# Altium schematic sheet argus_I.SchDoc: document_tile
size A; SheetNumber: 1; SheetTotal: 1
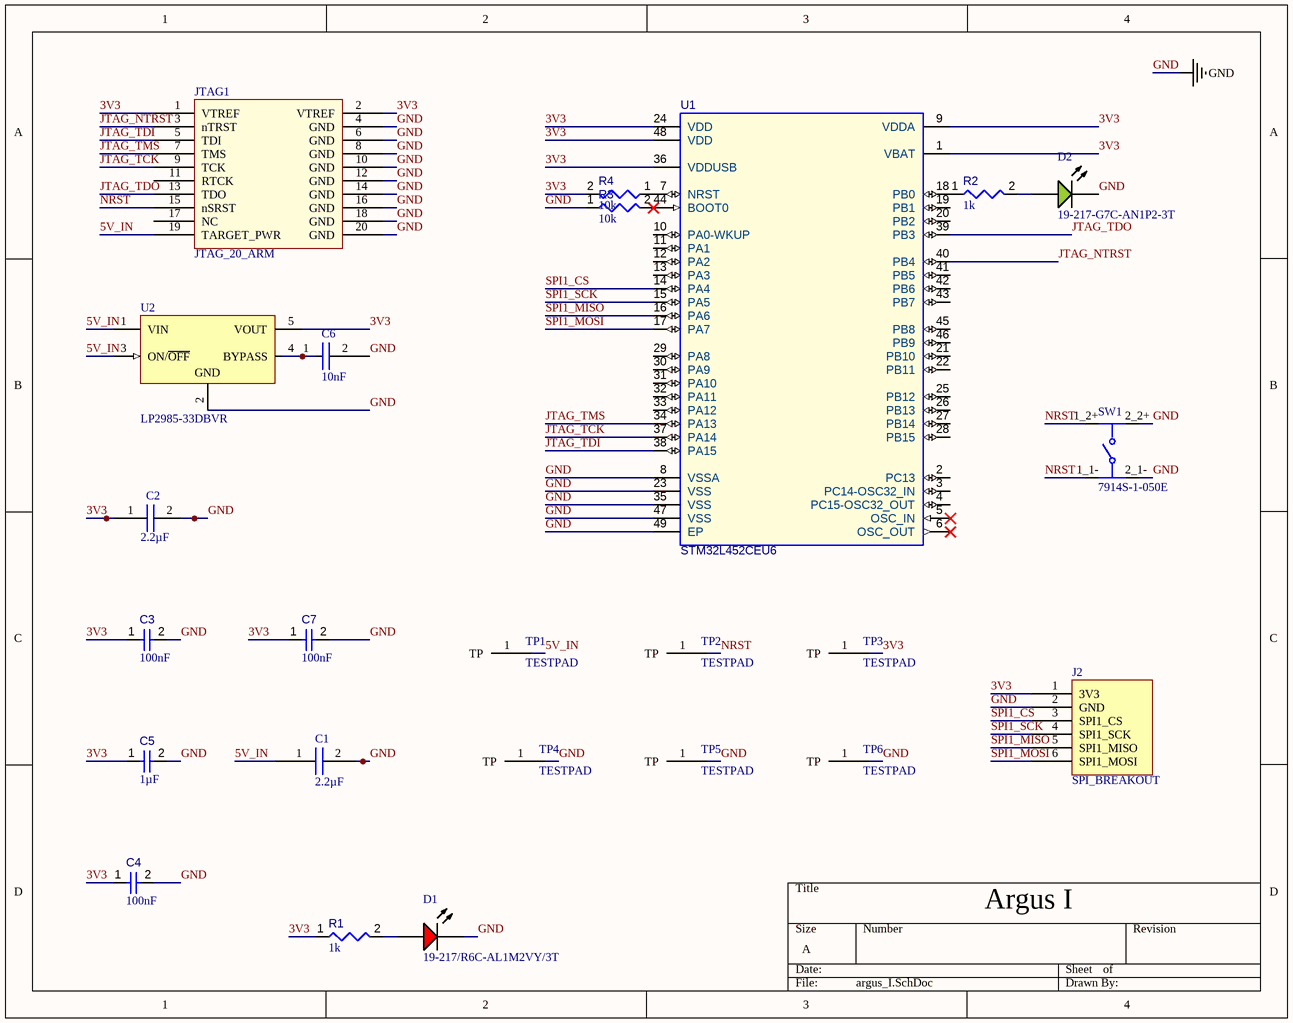
[diagram p0: argus_I.SchDoc]

## Parts
C1  2.2µF  [CAPC0402_1005_NO_SILK]
C2  2.2µF  [CAPC0402_1005_NO_SILK]
C3  value 100nF  [CAPC1608X90X40NL10T20]  (hidden comment: Capacitor 100 nF +/-10% 50 V 0603)
C4  value 100nF  [CAPC1608X90X40NL10T20]  (hidden comment: Capacitor 100 nF +/-10% 50 V 0603)
C5  value 1µF  [CAPC1608X94X35NL15T15]  (hidden comment: Capacitor 1 uF +/- 10% 16 V 0603)
C6  10nF  [CAPC0402_1005_NO_SILK]
C7  value 100nF  [CAPC1608X90X40NL10T20]  (hidden comment: Capacitor 100 nF +/-10% 50 V 0603)
D1  19-217/R6C-AL1M2VY/3T  [EVRL-0603-2_V]
D2  19-217-G7C-AN1P2-3T  [EVRL-0603-2_V]
J2  SPI_BREAKOUT  [HDR_1X06_2P54_TH]
JTAG1  JTAG_20_ARM  [JTAG_20_ARM_2X10_2P54_TH]
R1  value 1k  [RESC1608X55X25ML10T15]  (hidden comment: Resistor 1k +/-1% 0603 100 mW)
R2  value 1k  [RESC1608X55X25ML10T15]  (hidden comment: Resistor 1k +/-1% 0603 100 mW)
R3  value 10k  [RESC1608X55X25ML10T15]  (hidden comment: Resistor 10k +/-1% 0603 100 mW)
R4  value 10k  [RESC1608X55X25ML10T15]  (hidden comment: Resistor 10k +/-1% 0603 100 mW)
SW1  7914S-1-050E  [FP-7914S-1-050E-MFG]
TP1  TESTPAD  [TESTPAD_1_TH]
TP2  TESTPAD  [TESTPAD_1_TH]
TP3  TESTPAD  [TESTPAD_1_TH]
TP4  TESTPAD  [TESTPAD_1_TH]
TP5  TESTPAD  [TESTPAD_1_TH]
TP6  TESTPAD  [TESTPAD_1_TH]
U1  STM32L452CEU6  [STM-UFQFPN48_N]
U2  LP2985-33DBVR  [TI-DBV5_V]

## Nets
GND: C1.2 C2.2 C3.2 C4.2 C5.2 C6.2 C7.2 D1.2(K) D2.2(K) J2.2(GND) JTAG1.4(GND) JTAG1.6(GND) JTAG1.8(GND) JTAG1.10(GND) JTAG1.12(GND) JTAG1.14(GND) JTAG1.16(GND) JTAG1.18(GND) JTAG1.20(GND) R3.1 SW1.2_1-(2_1-) SW1.2_2+(2_2+) TP4.1(TP) TP5.1(TP) TP6.1(TP) U1.8(VSSA) U1.23(VSS) U1.35(VSS) U1.47(VSS) U1.49(EP) U2.2(GND)
3V3: C2.1 C3.1 C4.1 C5.1 C7.1 J2.1(3V3) JTAG1.1(VTREF) JTAG1.2(VTREF) R1.1 R4.2 TP3.1(TP) U1.1(VBAT) U1.9(VDDA) U1.24(VDD) U1.36(VDDUSB) U1.48(VDD) U2.5(VOUT)
5V_IN: C1.1 JTAG1.19(TARGET_PWR) TP1.1(TP) U2.1(VIN) U2.3(ON/~{OFF})
JTAG_NTRST: JTAG1.3(nTRST) U1.40(PB4)
JTAG_TCK: JTAG1.9(TCK) U1.37(PA14)
JTAG_TDI: JTAG1.5(TDI) U1.38(PA15)
JTAG_TDO: JTAG1.13(TDO) U1.39(PB3)
JTAG_TMS: JTAG1.7(TMS) U1.34(PA13)
NRST: JTAG1.15(nSRST) SW1.1_1-(1_1-) SW1.1_2+(1_2+) TP2.1(TP)
SPI1_CS: J2.3(SPI1_CS) U1.14(PA4)
SPI1_MISO: J2.5(SPI1_MISO) U1.16(PA6)
SPI1_MOSI: J2.6(SPI1_MOSI) U1.17(PA7)
SPI1_SCK: J2.4(SPI1_SCK) U1.15(PA5)
NetC6_1: C6.1 U2.4(BYPASS)
NetD1_1: D1.1(A) R1.2
NetD2_1: D2.1(A) R2.2
NetR2_1: R2.1 U1.18(PB0)
NetR3_2: R3.2 U1.44(BOOT0)
NetR4_1: R4.1 U1.7(NRST)

Not connected (* = marked no-connect by the designer): JTAG1 11(RTCK) 17(NC); U1 2(PC13) 3(PC14-OSC32_IN) 4(PC15-OSC32_OUT) 5(OSC_IN)* 6(OSC_OUT)* 10(PA0-WKUP) 11(PA1) 12(PA2) 13(PA3) 19(PB1) 20(PB2) 21(PB10) 22(PB11) 25(PB12) 26(PB13) 27(PB14) 28(PB15) 29(PA8) 30(PA9) 31(PA10) 32(PA11) 33(PA12) 41(PB5) 42(PB6) 43(PB7) 45(PB8) 46(PB9)

## Notes on the sheet
- Argus I

## Library data of the parts
C1 C2 C6 = CAP_0402_NO_SILK
C3 C4 C7 = CMP-001-00017-6: Chip Capacitor, 100 nF, +/- 10%, 50 V, 0603 (1608 Metric); Voltage Rating: 50V; Capacitor Type: Ceramic; Tolerance: 10%; Mounting Technology: SM; Max Operating Temperature: 125°C; RoHS Compliant: True; Pins: 2; Case/Package: 0603; Min Operating Temperature: -55°C
C5 = CMP-001-00003-6: Chip Capacitor, 1 uF, +/- 10%, 16 V, 0603 (1608 Metric); Voltage Rating: 16V; Capacitor Type: Ceramic; Max Operating Temperature: 125°C; Pins: 2; Tolerance: 10%; Min Operating Temperature: -55°C; RoHS Compliant: True; Mounting Technology: SM; Case/Package: 0603
D1 = CMP-007-00004-2: Chip LED, Red, 5 V, 25 mA, -40 to 85 degC, 2-Pin SMD (0603), RoHS, Tape and Reel; Manufacturer: Everlight Electronics; Forward Voltage: 2.2V; Lens Style: Clear; Package Reference: 0603; Datasheet Version: Rev. 1, 01/2005; Mounting Technology: SM; RoHS Compliant: False; Datasheet URL: https://datasheet.ciiva.com/4688/el-19-217-r6c-al1m2vy-3tpdf-187026-4688713.pdf; Case/Package: 0603; Colour: Red; Manufacturer URL: http://www.everlight.com/; Package Description: 2-Pin Surface Mount Device, Body 1.6 x 0.8 mm
D2 = CMP-007-00002-2: Chip LED, Yellow-Green, 5 V, 25 mA, -40 to 85 degC, 2-Pin SMD (0603), RoHS, Tape and Reel; Manufacturer: Everlight Electronics; Forward Voltage: 2V; Lens Style: Clear; Viewing Angle: 120degrees; Colour: Green; Mounting Technology: SM; Datasheet Version: Rev. 1, 04/2006; Package Description: 2-Pin Surface Mount Device, Body 1.6 x 0.8 mm; RoHS Compliant: True; Package Reference: 0603; Pins: 2; Manufacturer URL: http://www.everlight.com/; Datasheet URL: https://datasheet.ciiva.com/48679/19-217-g7c-an1p2-3t-48679179.pdf; Case/Package: 0603
J2 = HDR_1X6_2P54_TH
R1 R2 = CMP-009-00014-5: Chip Resistor, 1 KOhm, +/-1%, 0.1 W, -55 to 155 degC, 0603 (1608 Metric); Voltage Rating: 50V; Power: 100mW; Tolerance: 1%; Mounting Technology: SM; Pins: 2; Case/Package: 0603; Min Operating Temperature: -55°C; RoHS Compliant: True; Max Operating Temperature: 155°C
R3 R4 = CMP-009-00017-5: Chip Resistor, 10 KOhm, +/- 1%, 01 W, -55 to 155 degC, 0603 (1608 Metric); Voltage Rating: 50V; Power: 100mW; RoHS Compliant: True; Min Operating Temperature: -55°C; Pins: 2; Case/Package: 0603; Mounting Technology: SM; Max Operating Temperature: 155°C; Tolerance: 1%
SW1 = CMP-07427-000003-1: SWITCH TACTILE SPST-NO 0.1A 24V; Operating Force: 300gf; Current Rating: 100mA; Voltage Rating (DC): 16V; Illumination Type: Non-Illuminated; Throw Configuration: SPST; Switch Function: Off-Mom; Actuator Material: Rubber; Actuator Type: Standard; Mechanical Life: 100000Cycles; Depth: 7.85mm; Min Operating Temperature: -55°C; RoHS Compliant: Yes; Orientation: Right Angle; Packaging: Tape and Reel; Contact Material: Gold; Mount: Surface Mount; Termination: SMD/SMT; Length: 5mm; Series: 7914; Case/Package: SMD/SMT; Max Operating Temperature: 125°C; Contact Plating: Silver; Max Current Rating: 100mA; Package Quantity: 1
U1 = CMP-020-00022-3: ARM® Cortex®-M4 STM32L4 Microcontroller IC 32-Bit 80MHz 512KB (512K x 8) FLASH 48-UFQFPN (7x7); I/Os: 38; RAM Size: 160; Min Supply Voltage: 2V; ComponentLink1URL: http://www.st.com/; ComponentLink2Description: Datasheet; Mounting Technology: Surface Mount; ComponentLink2URL: http://www.st.com/st-web-ui/static/active/en/resource/technical/document/datasheet/CD00161566.pdf; Case/Package: UFQFN-48; Pins: 49; RoHS Compliant: Yes; ComponentLink1Description: Manufacturer URL
U2 = CMP-019-00026-3: Single Output Low Noise LDO, 150 mA, Fixed 3.3 V Output, 1.5% Tolerance, 2.2 to 16 V Input, Low IQ, 5-Pin SOT-23 (DBV), -40 to 125 degC, Green (RoHS & no Sb/Br), Tape and Reel; Manufacturer: Texas Instruments; Output Current: 150mA; Package Version: 4073253-4/N, 12/2014; Outputs: 1; Dropout Voltage: 3mV; Output Voltage: 3.3V; Max Input Voltage: 16V; Min Input Voltage: 2.2V; Package Description: 5-Pin Small Outline Transistor, Body 2.9 x 1.6 mm, Pitch 0.95 mm; Mounting Technology: SM; Min Operating Temperature: -40°C; Case/Package: SOT-23-5; Datasheet Version: SLVS522O, 01/2015; Package Reference: DBV5; Max Ouput Current: 150mA; Max Operating Temperature: 125°C; RoHS Compliant: True; Packaging: TapeandReel; Nominal Output Voltage: 3.3V; Package Quantity: 3000; Package URL: http://www.ti.com/lit/ml/mpds018l/mpds018l.pdf; Pins: 16; Manufacturer URL: http://www.ti.com/; Datasheet URL: http://www.ti.com/lit/ds/symlink/lp2985.pdf